# EAGLE design 7seg_clock_ver2 (EAGLE 9.6.2)
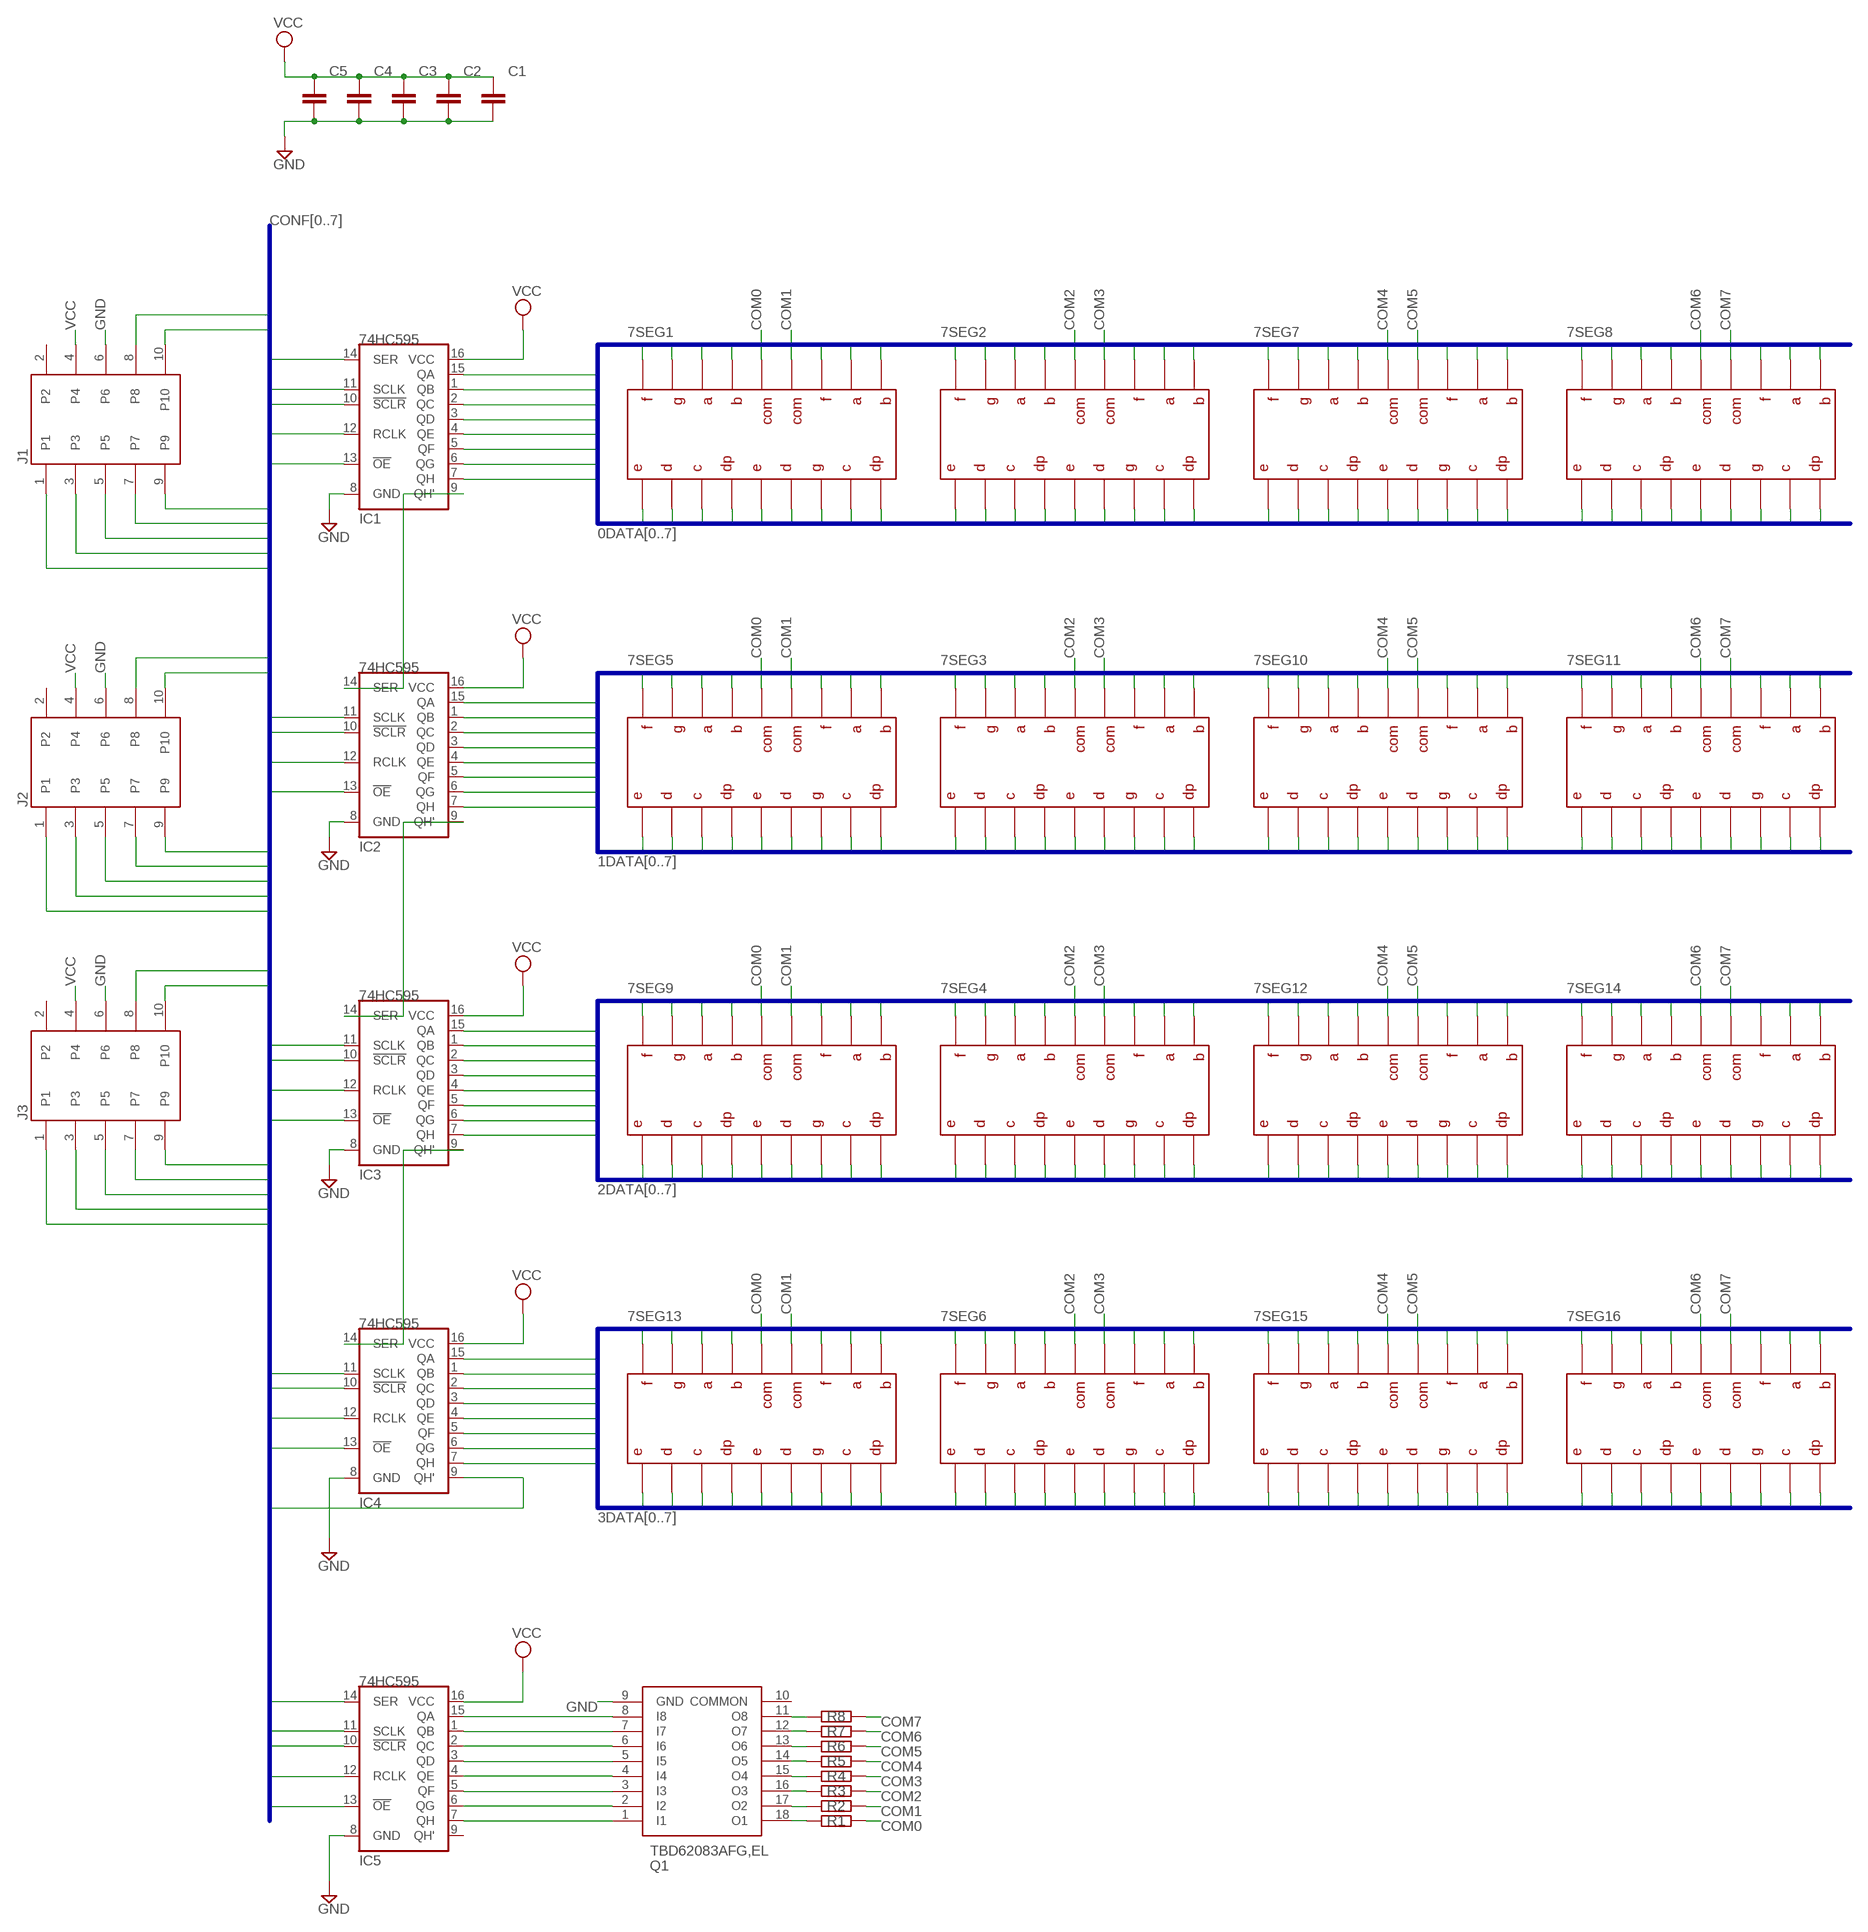
[diagram p0: schematic, sheet 1]

## Parts
7SEG1  SL-3264  [SL-3264]
7SEG2  SL-3264  [SL-3264]
7SEG3  SL-3264  [SL-3264]
7SEG4  SL-3264  [SL-3264]
7SEG5  SL-3264  [SL-3264]
7SEG6  SL-3264  [SL-3264]
7SEG7  SL-3264  [SL-3264]
7SEG8  SL-3264  [SL-3264]
7SEG9  SL-3264  [SL-3264]
7SEG10  SL-3264  [SL-3264]
7SEG11  SL-3264  [SL-3264]
7SEG12  SL-3264  [SL-3264]
7SEG13  SL-3264  [SL-3264]
7SEG14  SL-3264  [SL-3264]
7SEG15  SL-3264  [SL-3264]
7SEG16  SL-3264  [SL-3264]
C1  C_CHIP-0603(1608-METRIC)  [CAPC1608X85]
C2  C_CHIP-0603(1608-METRIC)  [CAPC1608X85]
C3  C_CHIP-0603(1608-METRIC)  [CAPC1608X85]
C4  C_CHIP-0603(1608-METRIC)  [CAPC1608X85]
C5  C_CHIP-0603(1608-METRIC)  [CAPC1608X85]
IC1  74HC595  [SO16]
IC2  74HC595  [SO16]
IC3  74HC595  [SO16]
IC4  74HC595  [SO16]
IC5  74HC595  [SO16]
J1  1241050-5  [TE_1241050-5]
J2  1241050-5  [TE_1241050-5]
J3  1241050-5  [TE_1241050-5]
Q1  TBD62083AFG,EL  [SOIC127P1030X245-18N]
R1  R_CHIP-0603(1608-METRIC)  [RESC1608X60]
R2  R_CHIP-0603(1608-METRIC)  [RESC1608X60]
R3  R_CHIP-0603(1608-METRIC)  [RESC1608X60]
R4  R_CHIP-0603(1608-METRIC)  [RESC1608X60]
R5  R_CHIP-0603(1608-METRIC)  [RESC1608X60]
R6  R_CHIP-0603(1608-METRIC)  [RESC1608X60]
R7  R_CHIP-0603(1608-METRIC)  [RESC1608X60]
R8  R_CHIP-0603(1608-METRIC)  [RESC1608X60]

## Nets
0DATA0: 7SEG1.P$10 7SEG1.P$15 7SEG2.P$10 7SEG2.P$15 7SEG7.P$10 7SEG7.P$15 7SEG8.P$10 7SEG8.P$15 IC1.15(QA)
0DATA1: 7SEG1.P$12 7SEG1.P$18 7SEG2.P$12 7SEG2.P$18 7SEG7.P$12 7SEG7.P$18 7SEG8.P$12 7SEG8.P$18 IC1.1(QB)
0DATA2: 7SEG1.P$7 7SEG1.P$17 7SEG2.P$7 7SEG2.P$17 7SEG7.P$7 7SEG7.P$17 7SEG8.P$7 7SEG8.P$17 IC1.2(QC)
0DATA3: 7SEG1.P$11 7SEG1.P$16 7SEG2.P$11 7SEG2.P$16 7SEG7.P$11 7SEG7.P$16 7SEG8.P$11 7SEG8.P$16 IC1.3(QD)
0DATA4: 7SEG1.P$4 7SEG1.P$9 7SEG2.P$4 7SEG2.P$9 7SEG7.P$4 7SEG7.P$9 7SEG8.P$4 7SEG8.P$9 IC1.4(QE)
0DATA5: 7SEG1.P$3 7SEG1.P$8 7SEG2.P$3 7SEG2.P$8 7SEG7.P$3 7SEG7.P$8 7SEG8.P$3 7SEG8.P$8 IC1.5(QF)
0DATA6: 7SEG1.P$2 7SEG1.P$6 7SEG2.P$2 7SEG2.P$6 7SEG7.P$2 7SEG7.P$6 7SEG8.P$2 7SEG8.P$6 IC1.6(QG)
0DATA7: 7SEG1.P$1 7SEG1.P$5 7SEG2.P$1 7SEG2.P$5 7SEG7.P$1 7SEG7.P$5 7SEG8.P$1 7SEG8.P$5 IC1.7(QH)
1DATA0: 7SEG3.P$10 7SEG3.P$15 7SEG5.P$10 7SEG5.P$15 7SEG10.P$10 7SEG10.P$15 7SEG11.P$10 7SEG11.P$15 IC2.15(QA)
1DATA1: 7SEG3.P$12 7SEG3.P$18 7SEG5.P$12 7SEG5.P$18 7SEG10.P$12 7SEG10.P$18 7SEG11.P$12 7SEG11.P$18 IC2.1(QB)
1DATA2: 7SEG3.P$7 7SEG3.P$17 7SEG5.P$7 7SEG5.P$17 7SEG10.P$7 7SEG10.P$17 7SEG11.P$7 7SEG11.P$17 IC2.2(QC)
1DATA3: 7SEG3.P$11 7SEG3.P$16 7SEG5.P$11 7SEG5.P$16 7SEG10.P$11 7SEG10.P$16 7SEG11.P$11 7SEG11.P$16 IC2.3(QD)
1DATA4: 7SEG3.P$4 7SEG3.P$9 7SEG5.P$4 7SEG5.P$9 7SEG10.P$4 7SEG10.P$9 7SEG11.P$4 7SEG11.P$9 IC2.4(QE)
1DATA5: 7SEG3.P$3 7SEG3.P$8 7SEG5.P$3 7SEG5.P$8 7SEG10.P$3 7SEG10.P$8 7SEG11.P$3 7SEG11.P$8 IC2.5(QF)
1DATA6: 7SEG3.P$2 7SEG3.P$6 7SEG5.P$2 7SEG5.P$6 7SEG10.P$2 7SEG10.P$6 7SEG11.P$2 7SEG11.P$6 IC2.6(QG)
1DATA7: 7SEG3.P$1 7SEG3.P$5 7SEG5.P$1 7SEG5.P$5 7SEG10.P$1 7SEG10.P$5 7SEG11.P$1 7SEG11.P$5 IC2.7(QH)
2DATA0: 7SEG4.P$10 7SEG4.P$15 7SEG9.P$10 7SEG9.P$15 7SEG12.P$10 7SEG12.P$15 7SEG14.P$10 7SEG14.P$15 IC3.15(QA)
2DATA1: 7SEG4.P$12 7SEG4.P$18 7SEG9.P$12 7SEG9.P$18 7SEG12.P$12 7SEG12.P$18 7SEG14.P$12 7SEG14.P$18 IC3.1(QB)
2DATA2: 7SEG4.P$7 7SEG4.P$17 7SEG9.P$7 7SEG9.P$17 7SEG12.P$7 7SEG12.P$17 7SEG14.P$7 7SEG14.P$17 IC3.2(QC)
2DATA3: 7SEG4.P$11 7SEG4.P$16 7SEG9.P$11 7SEG9.P$16 7SEG12.P$11 7SEG12.P$16 7SEG14.P$11 7SEG14.P$16 IC3.3(QD)
2DATA4: 7SEG4.P$4 7SEG4.P$9 7SEG9.P$4 7SEG9.P$9 7SEG12.P$4 7SEG12.P$9 7SEG14.P$4 7SEG14.P$9 IC3.4(QE)
2DATA5: 7SEG4.P$3 7SEG4.P$8 7SEG9.P$3 7SEG9.P$8 7SEG12.P$3 7SEG12.P$8 7SEG14.P$3 7SEG14.P$8 IC3.5(QF)
2DATA6: 7SEG4.P$2 7SEG4.P$6 7SEG9.P$2 7SEG9.P$6 7SEG12.P$2 7SEG12.P$6 7SEG14.P$2 7SEG14.P$6 IC3.6(QG)
2DATA7: 7SEG4.P$1 7SEG4.P$5 7SEG9.P$1 7SEG9.P$5 7SEG12.P$1 7SEG12.P$5 7SEG14.P$1 7SEG14.P$5 IC3.7(QH)
3DATA0: 7SEG6.P$10 7SEG6.P$15 7SEG13.P$10 7SEG13.P$15 7SEG15.P$10 7SEG15.P$15 7SEG16.P$10 7SEG16.P$15 IC4.15(QA)
3DATA1: 7SEG6.P$12 7SEG6.P$18 7SEG13.P$12 7SEG13.P$18 7SEG15.P$12 7SEG15.P$18 7SEG16.P$12 7SEG16.P$18 IC4.1(QB)
3DATA2: 7SEG6.P$7 7SEG6.P$17 7SEG13.P$7 7SEG13.P$17 7SEG15.P$7 7SEG15.P$17 7SEG16.P$7 7SEG16.P$17 IC4.2(QC)
3DATA3: 7SEG6.P$11 7SEG6.P$16 7SEG13.P$11 7SEG13.P$16 7SEG15.P$11 7SEG15.P$16 7SEG16.P$11 7SEG16.P$16 IC4.3(QD)
3DATA4: 7SEG6.P$4 7SEG6.P$9 7SEG13.P$4 7SEG13.P$9 7SEG15.P$4 7SEG15.P$9 7SEG16.P$4 7SEG16.P$9 IC4.4(QE)
3DATA5: 7SEG6.P$3 7SEG6.P$8 7SEG13.P$3 7SEG13.P$8 7SEG15.P$3 7SEG15.P$8 7SEG16.P$3 7SEG16.P$8 IC4.5(QF)
3DATA6: 7SEG6.P$2 7SEG6.P$6 7SEG13.P$2 7SEG13.P$6 7SEG15.P$2 7SEG15.P$6 7SEG16.P$2 7SEG16.P$6 IC4.6(QG)
3DATA7: 7SEG6.P$1 7SEG6.P$5 7SEG13.P$1 7SEG13.P$5 7SEG15.P$1 7SEG15.P$5 7SEG16.P$1 7SEG16.P$5 IC4.7(QH)
COM0 [sup]: 7SEG1.P$14 7SEG5.P$14 7SEG9.P$14 7SEG13.P$14 R1.2
COM1 [sup]: 7SEG1.P$13 7SEG5.P$13 7SEG9.P$13 7SEG13.P$13 R2.2
COM2 [sup]: 7SEG2.P$14 7SEG3.P$14 7SEG4.P$14 7SEG6.P$14 R3.2
COM3 [sup]: 7SEG2.P$13 7SEG3.P$13 7SEG4.P$13 7SEG6.P$13 R4.2
COM4 [sup]: 7SEG7.P$14 7SEG10.P$14 7SEG12.P$14 7SEG15.P$14 R5.2
COM5 [sup]: 7SEG7.P$13 7SEG10.P$13 7SEG12.P$13 7SEG15.P$13 R6.2
COM6 [sup]: 7SEG8.P$14 7SEG11.P$14 7SEG14.P$14 7SEG16.P$14 R7.2
COM7 [sup]: 7SEG8.P$13 7SEG11.P$13 7SEG14.P$13 7SEG16.P$13 R8.2
CONF0: IC1.14(SER) J1.1 J2.1 J3.1
CONF1: IC1.11(SCLK) IC2.11(SCLK) IC3.11(SCLK) IC4.11(SCLK) IC5.11(SCLK) J1.7 J2.7 J3.7
CONF2: IC1.10(!SCLR) IC2.10(!SCLR) IC3.10(!SCLR) IC4.10(!SCLR) IC5.10(!SCLR) J1.9 J2.9 J3.9
CONF3: IC1.12(RCLK) IC2.12(RCLK) IC3.12(RCLK) IC4.12(RCLK) IC5.12(RCLK) J1.5 J2.5 J3.5
CONF4: IC1.13(!OE) IC2.13(!OE) IC3.13(!OE) IC4.13(!OE) IC5.13(!OE) J1.3 J2.3 J3.3
CONF5: IC4.9(QH') J1.10 J2.10 J3.10
CONF6: IC5.14(SER) J1.8 J2.8 J3.8
GND [sup]: C1.2 C2.2 C3.2 C4.2 C5.2 IC1.8(GND) IC2.8(GND) IC3.8(GND) IC4.8(GND) IC5.8(GND) J1.6 J2.6 J3.6 Q1.9(GND)
N$1: IC1.9(QH') IC2.14(SER)
N$2: Q1.18(O1) R1.1
N$3: Q1.17(O2) R2.1
N$4: IC3.9(QH') IC4.14(SER)
N$5: Q1.16(O3) R3.1
N$6: IC5.7(QH) Q1.1(I1)
N$7: IC5.6(QG) Q1.2(I2)
N$8: IC5.5(QF) Q1.3(I3)
N$9: IC5.4(QE) Q1.4(I4)
N$10: Q1.15(O4) R4.1
N$11: Q1.14(O5) R5.1
N$12: IC5.3(QD) Q1.5(I5)
N$13: IC5.2(QC) Q1.6(I6)
N$14: IC5.1(QB) Q1.7(I7)
N$15: IC5.15(QA) Q1.8(I8)
N$16: Q1.13(O6) R6.1
N$17: Q1.12(O7) R7.1
N$18: Q1.11(O8) R8.1
N$19: IC2.9(QH') IC3.14(SER)
VCC [sup]: C1.1 C2.1 C3.1 C4.1 C5.1 IC1.16(VCC) IC2.16(VCC) IC3.16(VCC) IC4.16(VCC) IC5.16(VCC) J1.4 J2.4 J3.4
Unconnected: IC5.9(QH') J1.2 J2.2 J3.2 Q1.10(COMMON)

## Buses
CONF[0..7]
3DATA[0..7]
2DATA[0..7]
1DATA[0..7]
0DATA[0..7]

## Library data of the parts
7SEG1-7SEG16 = SL3264:SL-3264; SL-3264: 三洋 7セグメントLED
C1-C5 = Capacitor:C: Capacitor - Generic; CATEGORY: Capacitor
IC1-IC5 = 74HC595N:74HC595: 8-bit SHIFT REGISTER, output latch Check availability <https://pricing.snapeda.com/parts/74HC595/Nexperia/view-part?ref=eda>; AVAILABILITY: In Stock; DESCRIPTION: Shift Register Single 8-Bit Serial to Serial/Parallel 16-Pin SSOP T/R; MF: Nexperia; MP: 74HC595; PACKAGE: None; PRICE: None; PURCHASE-URL: https://pricing.snapeda.com/search/part/74HC595/?ref=eda
J1-J3 = PinHead_2.54_2line:1241050-5: Conn Unshrouded Header HDR 10 POS 2.54mm Solder ST SMD Automotive T/R Check availability <https://pricing.snapeda.com/parts/1241050-5/TE%20Connectivity/view-part?ref=eda>; AVAILABILITY: In Stock; COMMENT: 1241050-5; DESCRIPTION: Conn Unshrouded Header HDR 10 POS 2.54mm Solder ST SMD Automotive Reel; EU_ROHS_COMPLIANCE: Compliant; MF: TE Connectivity; MP: 1241050-5; PACKAGE: None; PRICE: None; PURCHASE-URL: https://pricing.snapeda.com/search/part/1241050-5/?ref=eda
Q1 = TBD62083AFG_EL:TBD62083AFG,EL: Gate Drivers DMOS Transistor Array 7-CH, 50V/0.5A Source: Datasheet <https://componentsearchengine.com/Datasheets/1/TBD62083AFG,EL.pdf> Check availability <https://pricing.snapeda.com/parts/TBD62083AFG%2CEL/Toshiba%20Semiconductor/view-part?ref=eda>; AVAILABILITY: In Stock; DESCRIPTION: Power Switch/Driver 1:1 N-Channel 500mA 18-SOP; MF: Toshiba Semiconductor; MP: TBD62083AFG,EL; PACKAGE: SOIC-18 Toshiba Semiconductor and Storage; PRICE: None; PURCHASE-URL: https://pricing.snapeda.com/search/part/TBD62083AFG,EL/?ref=eda
R1-R8 = Resistor:R: Resistor Fixed - Generic; CATEGORY: Resistor; SUB-CATEGORY: Fixed

## Net classes
0 default: width 0.203 mm, clearance 0.203 mm
1 sup: width 0.762 mm, clearance 0.33 mm

## Board
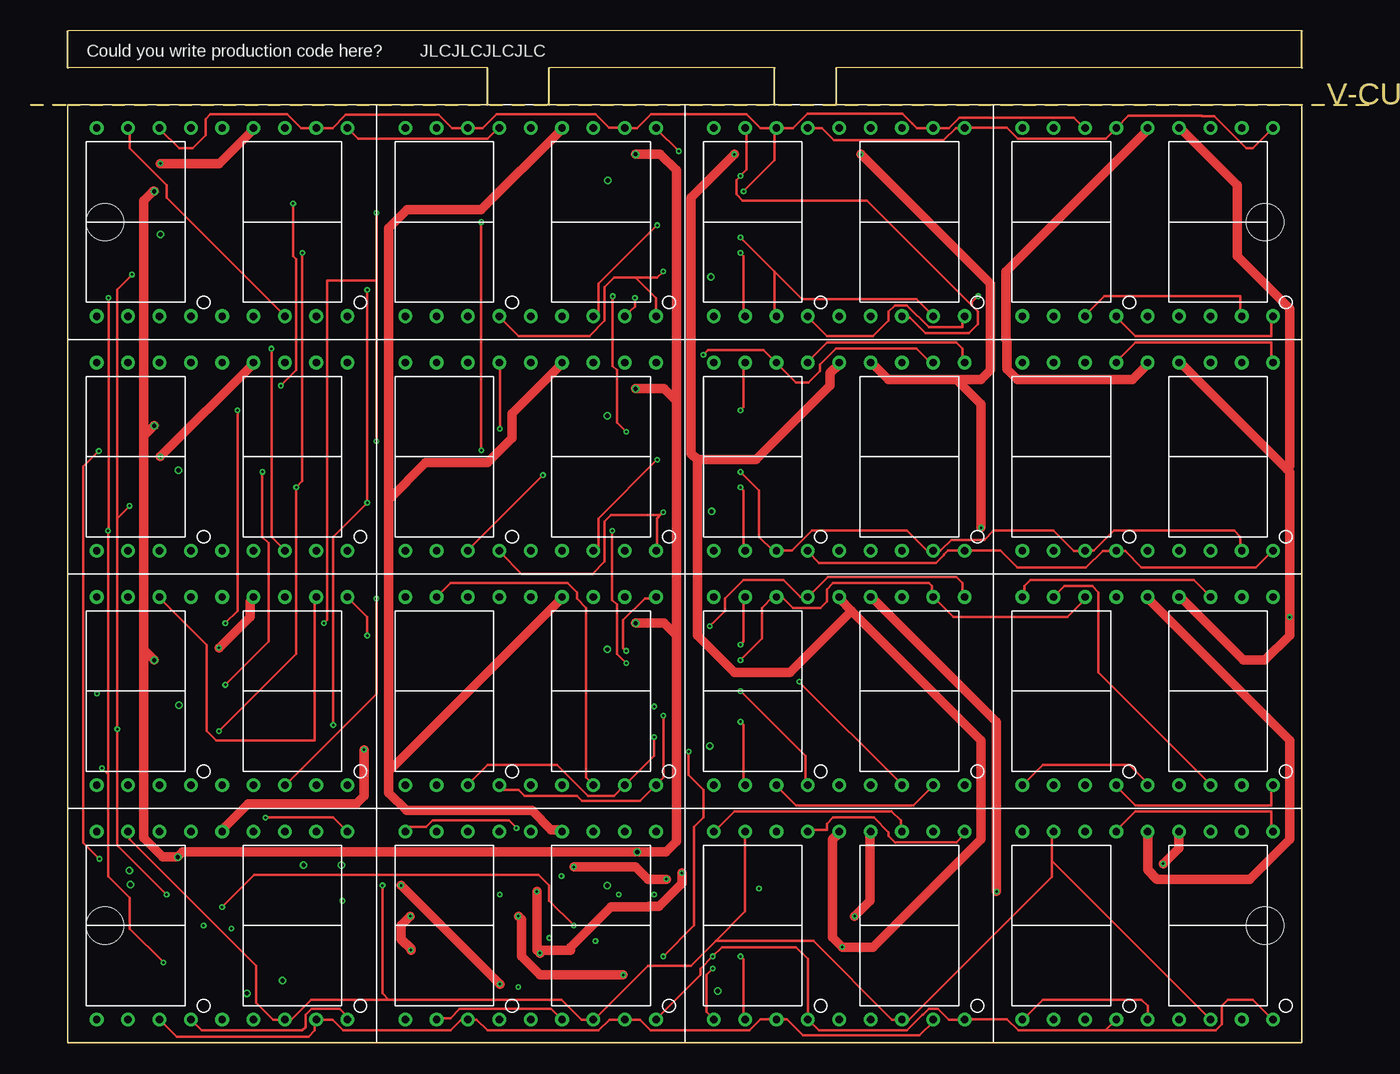
[diagram p1: board, top side]
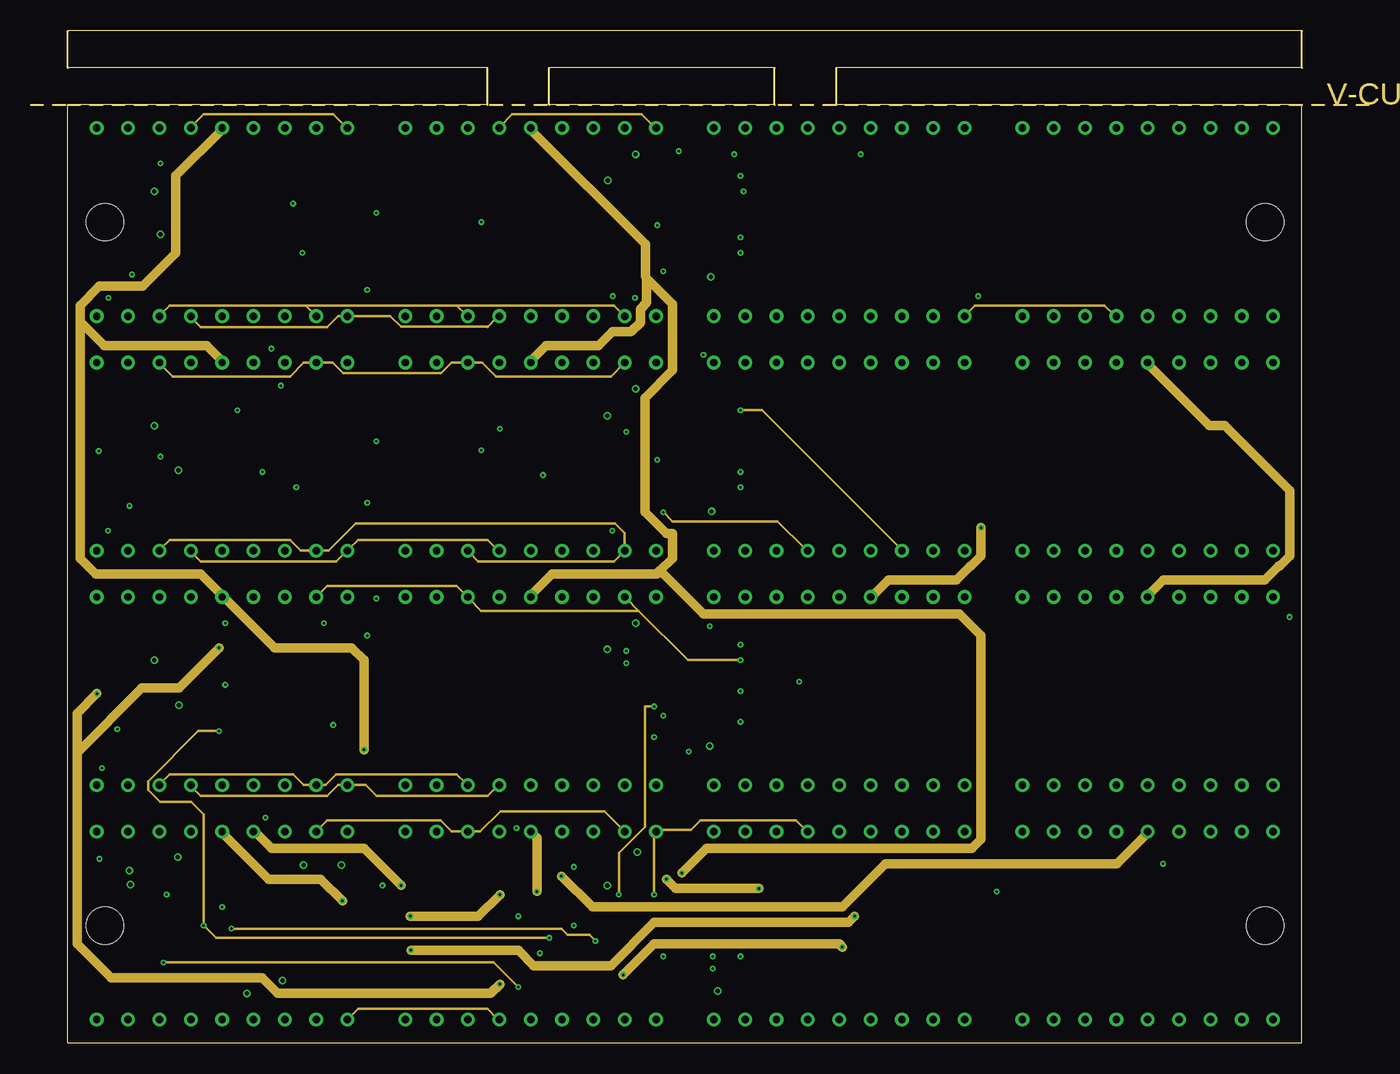
[diagram p2: board, inner layer Route2]
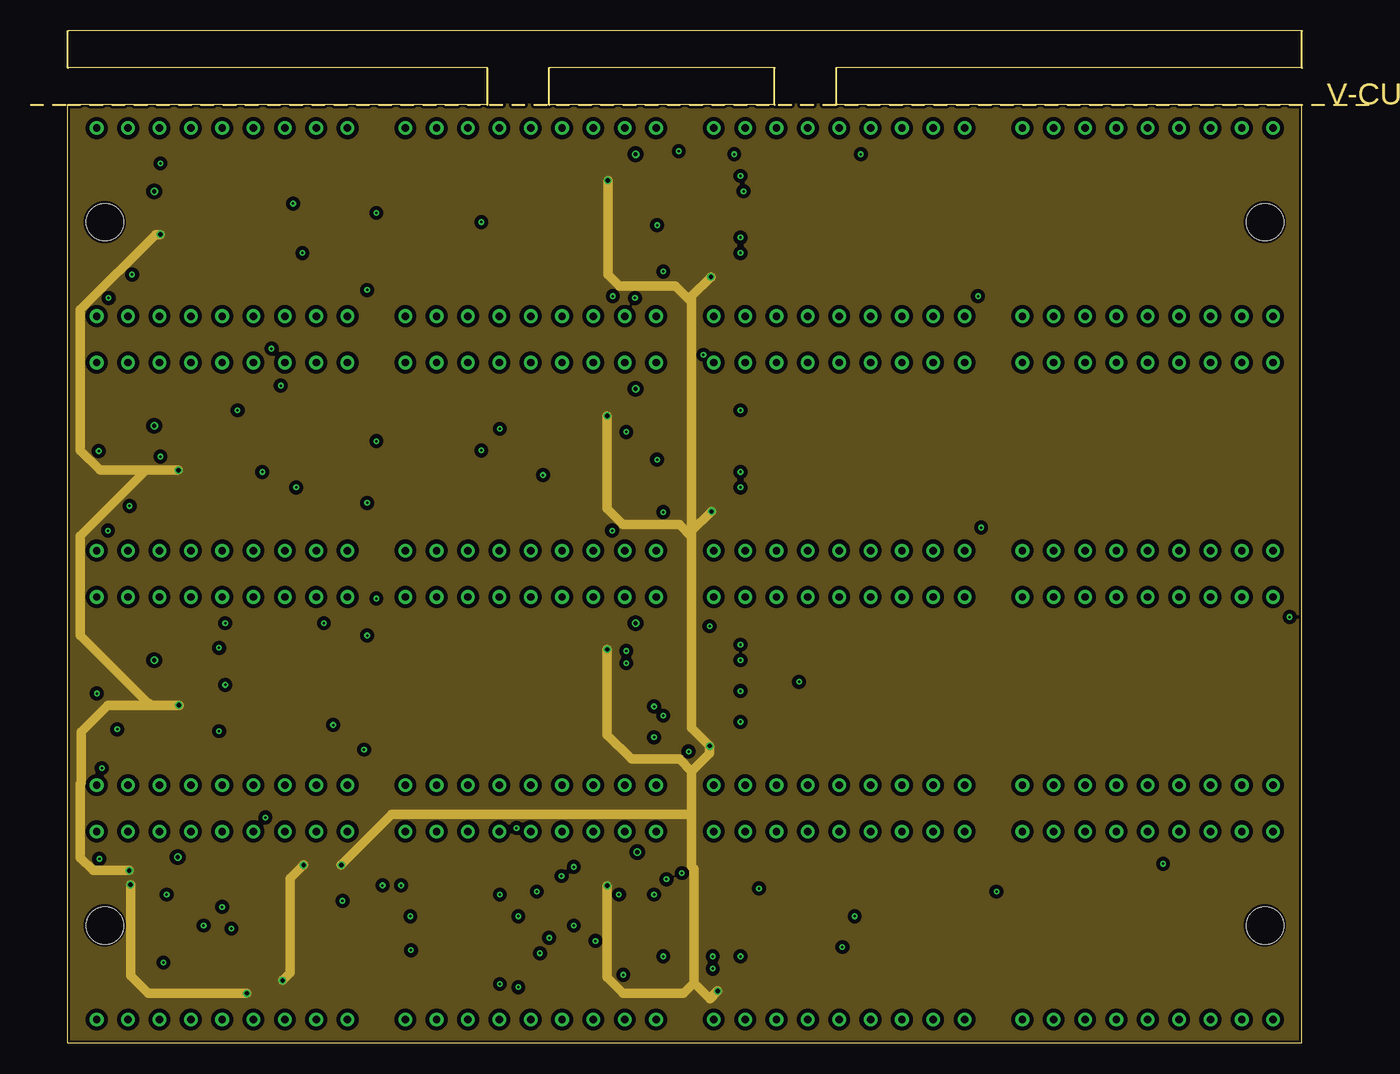
[diagram p3: board, inner layer Route15]
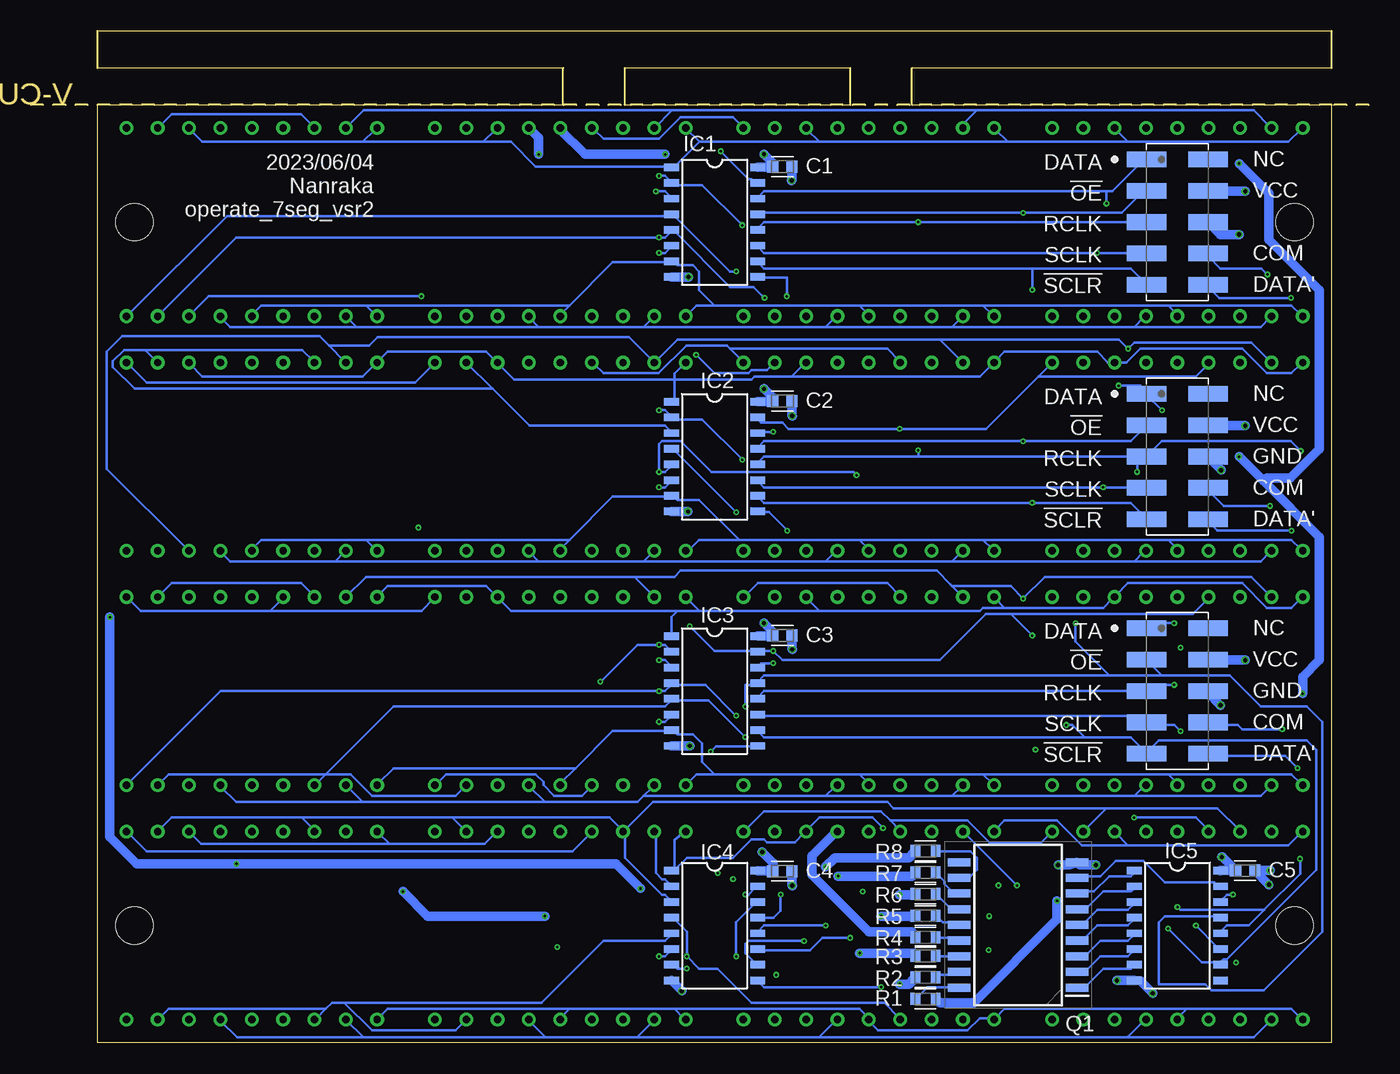
[diagram p4: board, bottom side, seen from below]

Size 108.4 x 82 mm. Coordinates in mm from the lower left corner, seen from the top.
Outline: 3,76 37,76 37,79 3,79 3,82 103,82 103,79 65.26,79 65.26,76 103,76 103,0 3,0 3,76
Outline: 0,76 3,76
Outline: 3,76 109,76
Outline: 42,76 42,79 60.26,79 60.26,76 42,76
Copper layers (1+2*15+16): Top 0.035mm / dielectric 0.2mm / Route2 0.0175mm / dielectric 1.065mm / Route15 0.0175mm / dielectric 0.2mm / Bottom 0.035mm
Design rules "jlcpcb-4layers": minimum track width 3.5mil, minimum drill 0.2mm, track to track 5mil, track to pad 0.2mm, pad to pad 5mil, via to via 0.5mm, smd to smd 5mil, copper to edge 0.2mm, drill to drill 6mil, minimum pad ring 10mil, minimum via ring 0.13mm, stop-mask expansion 0.05mm, vias tented up to drill 16mil, thermal gap 10mil
Holes 3 mm at 6,66.5 6,9.5 100,9.5 100,66.5

### Footprints (pad centres in the part's own frame; a part is rotated, then mirrored left to right if it is on the bottom)
SL-3264 = drill 0.6: P$1 -10.16,-7.62; P$2 -7.62,-7.62; P$3 -5.08,-7.62; P$4 -2.54,-7.62; P$5 0,-7.62; P$6 2.54,-7.62; P$7 5.08,-7.62; P$8 7.62,-7.62; P$9 10.16,-7.62; P$10 10.16,7.62; P$11 7.62,7.62; P$12 5.08,7.62; P$13 2.54,7.62; P$14 0,7.62; P$15 -2.54,7.62; P$16 -5.08,7.62; P$17 -7.62,7.62; P$18 -10.16,7.62
CAPC1608X85 = smd 0.921 x 0.97: 1 -0.775,0; 2 0.775,0
SO16 = smd 0.6 x 1.2: 1 -4.445,-3.494; 2 -3.175,-3.494; 3 -1.905,-3.494; 4 -0.635,-3.494; 5 0.635,-3.494; 6 1.905,-3.494; 7 3.175,-3.494; 8 4.445,-3.494; 9 4.445,3.494; 10 3.175,3.494; 11 1.905,3.494; 12 0.635,3.494; 13 -0.635,3.494; 14 -1.905,3.494; 15 -3.175,3.494; 16 -4.445,3.494
TE_1241050-5 = smd 1.27 x 3.2: 1 -5.08,-2.5; 2 -5.08,2.5; 3 -2.54,-2.5; 4 -2.54,2.5; 5 0,-2.5; 6 0,2.5; 7 2.54,-2.5; 8 2.54,2.5; 9 5.08,-2.5; 10 5.08,2.5
SOIC127P1030X245-18N = smd 1.8 x 0.65: 1 -4.775,5.08; 2 -4.775,3.81; 3 -4.775,2.54; 4 -4.775,1.27; 5 -4.775,0; 6 -4.775,-1.27; 7 -4.775,-2.54; 8 -4.775,-3.81; 9 -4.775,-5.08; 10 4.775,-5.08; 11 4.775,-3.81; 12 4.775,-2.54; 13 4.775,-1.27; 14 4.775,0; 15 4.775,1.27; 16 4.775,2.54; 17 4.775,3.81; 18 4.775,5.08
RESC1608X60 = smd 0.799 x 0.974: 1 -0.815,0; 2 0.815,0

### Placement (x,y rotation side)
7SEG1  15.5,66.5 0 top
7SEG2  40.5,66.5 0 top
7SEG3  40.5,47.5 0 top
7SEG4  40.5,28.5 0 top
7SEG5  15.5,47.5 0 top
7SEG6  40.5,9.5 0 top
7SEG7  65.5,66.5 0 top
7SEG8  90.5,66.5 0 top
7SEG9  15.5,28.5 0 top
7SEG10  65.5,47.5 0 top
7SEG11  90.5,47.5 0 top
7SEG12  65.5,28.5 0 top
7SEG13  15.5,9.5 0 top
7SEG14  90.5,28.5 0 top
7SEG15  65.5,9.5 0 top
7SEG16  90.5,9.5 0 top
C1  47.5,71 0 bottom
C2  47.5,52 0 bottom
C3  47.5,33 0 bottom
C4  47.5,13.9 0 bottom
C5  10,13.95 0 bottom
IC1  53,66.5 270 bottom
IC2  53,47.5 270 bottom
IC3  53,28.5 270 bottom
IC4  53,9.5 270 bottom
IC5  15.5,9.5 270 bottom
J1  15.5,66.5 270 bottom
J2  15.5,47.5 270 bottom
J3  15.5,28.5 270 bottom
Q1  28.4,9.55 180 bottom
R1  35.9,3.55 0 bottom
R2  35.9,5.3 180 bottom
R3  35.9,7.05 180 bottom
R4  35.9,8.55 180 bottom
R5  35.9,10.3 180 bottom
R6  35.9,12.05 180 bottom
R7  35.9,13.8 180 bottom
R8  35.9,15.55 180 bottom

### Tracks (layer width: path | path; a pad name or v marks a point on that pad's centre or on a via)
0DATA0  (via drill 0.2)
  Top 0.203: 7SEG2.P$15 37.75,74 37,73.25 26.53,73.25 7SEG1.P$10 | v52.5,72.25 50.75,74 7SEG2.P$10 | 7SEG8.P$10 100.5,74 99,72.5 98.5,72.5 95.9,75.1 94.9,75.1 94.89,75.11 88.95,75.11 7SEG8.P$15 87.1,73.26 79.98,73.26 79.09,74.15 75.69,74.15 7SEG7.P$10 74.94,74.12 73.96,73.13 65.09,73.13 64.11,74.12 7SEG7.P$15
  Route2 0.203: 7SEG1.P$15 13,74.25 14,75.25 24.5,75.25 25.5,74.25 7SEG1.P$10 | 7SEG2.P$15 38,74.25 39,75.25 49.5,75.25 50.5,74.25 7SEG2.P$10
  Bottom 0.203: v52.5,72.25 50.25,70 50,70 49.75,69.75 IC1.15 | 7SEG7.P$15 62.75,74 62,73.25 57.5,73.25 55.75,75 51.5,75 50.75,74.25 7SEG2.P$10
0DATA1
  Bottom 0.203: 19.5,73 6.5,73 5.5,74 7SEG1.P$18 | 19.5,73 20.5,74 7SEG1.P$12 | 29.25,73 30.25,74 7SEG2.P$18 | 19.5,73 29.25,73 | 71.75,73 70.75,74 7SEG7.P$12 | 81.5,73 71.75,73 | 81.5,73 94.5,73 95.5,74 7SEG8.P$12 | 81.5,73 80.5,74 7SEG8.P$18 | 44.5,73 45.5,74 7SEG2.P$12 | 29.25,73 44.5,73 | 7SEG7.P$18 54.22,73 | 54.22,73 44.5,73 | 54.22,73 56.27,70.94 IC1.1 56.5,71 67.5,71 69.5,73 71.75,73
0DATA2  (via drill 0.2)
  Top 0.203: 7SEG1.P$7 20.5,59 11,68.5 11,69.5 8,72.5 8,74 7SEG1.P$17 | 7SEG7.P$17 58,74 58,70.75 v57.5,70.25 57.16,69.91 57.16,68.76 57.67,68.25 67.75,68.25 76.25,59.75 | v50.75,66.25 46,61.5 46,59.25 45.75,59 7SEG2.P$7 | 76.25,59.75 76.75,59.25 76.75,58.25 76,57.5 72.5,57.5 71.25,58.75 70.75,58.75 7SEG7.P$7 | v76.75,60.5 76.25,60 76.25,59.75
  Bottom 0.203: 7SEG2.P$17 32.88,74.43 31.75,75.56 | 31.75,75.56 9.31,75.56 8,74.25 7SEG1.P$17 | v57.5,70.25 57,70.25 56.5,69.75 IC1.2 56.25,69.5 54,69.5 v50.75,66.25 | 7SEG8.P$17 81.45,75.55 56.45,75.55 | v76.75,60.5 94,60.5 95.5,59 7SEG8.P$7 | 7SEG7.P$17 56.45,75.55 | 56.45,75.55 56.44,75.56 31.75,75.56
0DATA3  (via drill 0.2)
  Top 0.203: 7SEG1.P$16 10.5,74 12,72.5 13.1,72.5 14.15,73.55 14.15,74.85 14.55,75.25 20.75,75.25 21.9,74.1 23.1,74.1 7SEG1.P$11 24.45,74.12 25.52,75.2 33.05,75.2 34.13,74.12 7SEG2.P$16 36.62,74.12 37.75,75.25 45.75,75.25 46.85,74.15 48.09,74.15 7SEG2.P$11 49.12,74.12 50.25,75.25 58,75.25 59.13,74.12 7SEG7.P$16 | v57.75,69 60.25,71.5 60.25,74 7SEG7.P$16 | 7SEG8.P$16 85.25,74.25 84.52,74.98 75.23,74.98 74.37,74.12 7SEG7.P$11 71.78,74.12 71.44,74.46 71.44,74.48 70.61,75.31 62.93,75.31 61.74,74.12 7SEG7.P$16
  Bottom 0.203: v57.75,69 57,69 56.5,68.5 IC1.3 | 7SEG8.P$11 98,74.25 97,75.25 86.5,75.25 85.5,74.25 7SEG8.P$16
0DATA4  (via drill 0.2)
  Top 0.203: 7SEG7.P$4 63,58.75 64.5,57.25 68.25,57.25 69.5,58.5 69.5,59.25 70,59.75 71,59.75 72.75,58 75.5,58 75.5,58.75 7SEG7.P$9 | 7SEG8.P$4 88,58.75 89.5,57.25 100.5,57.25 100.5,58.75 7SEG8.P$9 | v51.25,62.5 50.75,62 49,62 | 7SEG2.P$4 38,58.75 39.5,57.25 45.25,57.25 46.5,58.5 46.5,61.25 47.25,62 49,62 | 49,62 50.66,60.34 7SEG2.P$9
  Route2 0.203: 7SEG7.P$9 75.75,59 76.5,59.75 87,59.75 87.75,59 7SEG8.P$4 | 7SEG1.P$4 13,58.75 13.75,58 24,58 24.88,58.88 7SEG1.P$9 29.12,58.88 29.98,58.02 36.98,58.02 37,58 37.75,58.75 7SEG2.P$4
  Bottom 0.203: v51.25,62.5 51.75,62.5 56.25,67 IC1.4 56.5,67 92.5,67 100.5,59 7SEG8.P$9
0DATA5  (via drill 0.2)
  Top 0.203: 7SEG8.P$3 85.5,59 87,60.5 98,60.5 98,59 7SEG8.P$8 | v57.5,65.25 60.25,62.5 | 60.25,62.5 60.25,60.25 60.25,59 7SEG7.P$3 | 7SEG7.P$8 71.75,60.25 63,60.25 62.5,60.25 60.25,62.5 | v48.95,60.35 48.95,59.65 7SEG2.P$8
  Route2 0.203: 22.25,59.75 11.25,59.75 10.5,59 7SEG1.P$3 | 7SEG1.P$8 22.25,59.75 | 34.5,59.75 35.25,59 7SEG2.P$3 | 22.25,59.75 34.5,59.75 | 7SEG2.P$8 47.25,59.75 34.5,59.75
  Bottom 0.203: 7SEG8.P$8 91.75,65.25 v57.5,65.25 57,65.25 56.5,65.75 IC1.5 56.25,65.75 51.75,61.25 49.85,61.25 v48.95,60.35
0DATA6  (via drill 0.2)
  Top 0.203: v57.5,64 57.75,63.75 57.75,59 7SEG7.P$2
  Bottom 0.203: 7SEG1.P$2 8,58.75 8.75,58 17,58 17.25,58 19,58 | 33.75,58 33,58.75 7SEG2.P$2 | 44,58 33.75,58 | 19,58 18.25,58.75 7SEG1.P$6 | 33.75,58 19,58 | 82,58 92.25,58 93,58.75 7SEG8.P$6 | v57.5,64 57,64 56.5,64.5 IC1.6 | 67.25,58 68,58.75 7SEG7.P$6 | 58.75,58 67.25,58 | 58.75,58 58,58.75 7SEG7.P$2 | 82,58 7SEG8.P$2 | 67.25,58 82,58 | 44,58 43.25,58.75 7SEG2.P$6 | 58.75,58 44,58
0DATA7
  Bottom 0.203: 16.25,59.75 6.25,59.75 5.5,59 7SEG1.P$1 | 31.25,59.75 30.5,59 7SEG2.P$1 | 31.25,59.75 39.75,59.75 41.25,59.75 | 16.25,59.75 15.5,59 7SEG1.P$5 | 31.25,59.75 16.25,59.75 | 81.25,59.75 80.5,59 7SEG8.P$1 | 81.25,59.75 89.75,59.75 90.5,59 7SEG8.P$5 | 64.75,59.75 61.25,63.25 56.5,63.25 IC1.7 56.25,63.25 56,63 54.75,63 54.25,62.5 54.25,61 53,59.75 | 64.75,59.75 65.5,59 7SEG7.P$5 | 41.25,59.75 40.5,59 7SEG2.P$5 | 53,59.75 54.47,59.75 7SEG7.P$1 | 53,59.75 41.25,59.75 | 64.75,59.75 81.25,59.75
1DATA0  (via drill 0.2)
  Top 0.203: 7SEG11.P$15 88,55.25 89.5,56.75 100.5,56.75 100.5,55.25 7SEG11.P$10 | 7SEG10.P$15 63,55.25 64.5,56.75 75,56.75 75.5,56.25 75.5,55.25 7SEG10.P$10 | v38,49.75 38,55 7SEG3.P$15
  Bottom 0.203: 26.75,54 25.75,55 7SEG5.P$10 | 26.75,54 31,49.75 v38,49.75 47,49.75 47.5,50.25 49.25,50.25 49.5,50.5 IC2.15 | 26.75,54 14,54 13,55 7SEG5.P$15 | 7SEG3.P$15 38,55.25 39,56.25 51.75,56.25 | 51.75,56.25 52,56.5 55.28,56.5 57.53,54.25 62,54.25 62.75,55 7SEG10.P$15 | 51.75,56.25 50.75,55.25 7SEG3.P$10 | 7SEG11.P$10 100.5,55 99,53.5 77.25,53.5 75.75,55 7SEG10.P$10
1DATA1
  Bottom 0.203: 7SEG5.P$18 5.5,55 6.25,54.25 8.25,54.25 10.25,56.25 18.5,56.25 19.65,55.1 20.56,55.1 7SEG5.P$12 21.12,55.12 22,56 29.5,56 30.25,55.25 7SEG3.P$18 30.5,55 31.5,54 46.75,54 | 56.25,53.75 56.25,52 IC2.1 | 46.75,54 45.75,55 7SEG3.P$12 | 46.75,54 49.75,54 50,53.75 56.25,53.75 | 7SEG11.P$12 95.5,55 94.5,54 81.5,54 80.5,55 7SEG11.P$18 80.25,55.25 79.5,56 71.5,56 70.75,55.25 7SEG10.P$12 70.5,55 69.25,53.75 56.25,53.75 | 7SEG10.P$18 56.25,54.21 56.25,53.75
1DATA2  (via drill 0.2)
  Top 0.203: v19.5,56.25 19.5,41 20.5,40 7SEG5.P$7 | v57.5,51.25 57.75,51.5 57.75,55 7SEG10.P$17 | v50.75,47.25 46,42.5 46,40.25 45.75,40 7SEG3.P$7
  Route2 0.203: v57.5,51.25 59.25,51.25 70.5,40 7SEG10.P$7
  Bottom 0.203: 7SEG5.P$17 8,55.25 9.5,56.75 19,56.75 v19.5,56.25 20.25,57 31,57 34.75,57 | v57.5,51.25 57,51.25 56.5,50.75 IC2.2 56.25,50.5 54,50.5 v50.75,47.25 | 84.25,56.5 83,55.25 7SEG11.P$17 | 7SEG11.P$7 95.75,40 102.25,46.5 102.25,56 101,57.25 85,57.25 84.25,56.5 | 34.75,57 33,55.25 7SEG3.P$17 | 34.75,57 56,57 7SEG10.P$17 58,55.25 59.95,57.2 80.3,57.2 81,56.5 84.25,56.5
1DATA3  (via drill 0.2)
  Top 0.203: 7SEG10.P$11 73,55 71.75,56.25 65.24,56.25 63.94,54.95 63.94,54.44 63,53.5 62,53.5 60.5,55 7SEG10.P$16 60.25,55.25 59.38,56.12 54.88,56.12 v54.5,55.75
  Route2 0.203: 7SEG5.P$16 10.5,55 11.5,54 21,54 22.1,55.1 23.1,55.1 7SEG5.P$11 24.45,55.12 25.3,54.26 25.99,54.26 26,54.25 33,54.25 33.01,54.26 33.24,54.26 34.09,55.12 7SEG3.P$16 36.58,55.12 37.7,54 47,54 7SEG3.P$11
  Bottom 0.203: 7SEG11.P$16 85.5,55.25 86.4,56.15 97.1,56.15 99.05,56.15 | 7SEG10.P$11 71,53 | 71,53 68,50 57,50 56.5,49.5 IC2.3 | 7SEG11.P$11 99.1,56.1 99.05,56.15 | 99.05,56.15 100.85,56.15 101.75,55.25 101.75,54.75 100,53 71,53 | v54.5,55.75 53,54.25 50.25,54.25 50,54.5 48.75,54.5 48.25,55 7SEG3.P$11
1DATA4  (via drill 0.2)
  Top 0.203: 7SEG10.P$4 63,39.75 63.88,38.88 73.33,38.88 73.98,39.52 73.98,39.56 74.3,39.88 7SEG10.P$9 78.57,39.88 79.95,38.5 85.5,38.5 86.85,39.85 87.93,39.85 7SEG11.P$4 88.01,39.83 88.67,39.83 90,38.5 99.25,38.5 100.5,39.75 7SEG11.P$9 | 51,42.75 50.75,42.5 50.75,40 7SEG3.P$9 | 51,42.75 v51.25,43 | 51,42.75 47,42.75 46.5,42.25 46.5,39 45.5,38 39.75,38 38,39.75 7SEG3.P$4
  Route2 0.203: 7SEG5.P$4 13,39.75 13.75,39 24.75,39 25.5,39.75 7SEG5.P$9 25.75,40 26.5,40.75 37,40.75 37.75,40 7SEG3.P$4 | v51.25,43 52,42.25 60.5,42.25 62.75,40 7SEG10.P$4
  Bottom 0.203: v51.25,43 56.25,48 IC2.4
1DATA5  (via drill 0.2)
  Top 0.203: 7SEG11.P$8 98,40 98,41 97.5,41.5 87.75,41.5 86.13,39.88 7SEG11.P$3 85.39,39.85 84.5,39.85 82.85,41.5 78,41.5 77.25,40.75 74.59,40.75 73.72,39.88 7SEG10.P$8 72.62,39.88 71,41.5 63.3,41.5 61.68,39.88 7SEG10.P$3 60.12,39.88 59,41 59,44.75 v57.5,46.25 | v41.5,46 35.5,40 7SEG3.P$3
  Route2 0.203: 7SEG5.P$3 10.5,40 11.25,40.75 21,40.75 21.87,39.88 7SEG5.P$8 24.13,39.88 26.34,42.09 47.34,42.09 48.12,41.31 7SEG3.P$8 47.24,39 36.25,39 35.5,39.75 7SEG3.P$3
  Bottom 0.203: IC2.5 56.5,46.75 57,46.25 v57.5,46.25 57.5,48.5 57.25,48.75 55.75,48.75 53.25,46.25 41.75,46.25 v41.5,46
1DATA6  (via drill 0.2)
  Top 0.203: v57.5,45 57.75,44.75 57.75,40 7SEG10.P$2
  Bottom 0.203: 19,39 8.75,39 8,39.75 7SEG5.P$2 | 33.75,39 33,39.75 7SEG3.P$2 | 33.75,39 42.25,39 44,39 | 19,39 18.25,39.75 7SEG5.P$6 | 33.75,39 19,39 | 83.75,39 83,39.75 7SEG11.P$2 | 83.75,39 92.25,39 93,39.75 7SEG11.P$6 | v57.5,45 57,45 56.5,45.5 IC2.6 | 67.25,39 68,39.75 7SEG10.P$6 | 58.75,39 67.25,39 | 58.75,39 58,39.75 7SEG10.P$2 | 67.25,39 83.75,39 | 44,39 43.25,39.75 7SEG3.P$6 | 58.75,39 44,39
1DATA7
  Bottom 0.203: 16.25,40.75 6.25,40.75 5.5,40 7SEG5.P$1 | 31.25,40.75 30.5,40 7SEG3.P$1 | 16.25,40.75 15.5,40 7SEG5.P$5 | 31.25,40.75 16.25,40.75 | 81.25,40.75 80.5,40 7SEG11.P$1 | 81.25,40.75 89.75,40.75 90.5,40 7SEG11.P$5 | 64.75,40.75 61.25,44.25 56.5,44.25 IC2.7 56.25,44.25 56,44 54.25,44 51,40.75 | 64.75,40.75 65.5,40 7SEG10.P$5 | 64.75,40.75 81.25,40.75 | 41.25,40.75 40.5,40 7SEG3.P$5 | 51,40.75 54.25,40.75 55.12,39.88 7SEG10.P$1 | 51,40.75 41.25,40.75 | 31.25,40.75 41.25,40.75
2DATA0  (via drill 0.2)
  Top 0.203: 7SEG12.P$10 75.5,36.25 75.5,37.25 75,37.75 64.59,37.75 7SEG12.P$15 62.38,36.12 61,37.5 57.75,37.5 56.25,36 56.25,35 v55,33.75 | v48.25,31.75 48,32 48,34.25 49.75,36 50.5,36 7SEG4.P$10 | v27.25,33 27.25,34.5 25.75,36 7SEG9.P$10
  Bottom 0.203: 89,35 76.75,35 75.75,36 7SEG12.P$10 | 89,35 99.5,35 100.5,36 7SEG14.P$10 | 89,35 88,36 7SEG14.P$15 | 29,34.75 31,34.75 34.75,31 47.5,31 v48.25,31.75 49.5,31.75 IC3.15 49.75,31.75 53,31.75 v55,33.75 | 29,34.75 27.25,34.75 14.25,34.75 13,36 7SEG9.P$15 | 7SEG4.P$15 38,36.25 39,37.25 49.5,37.25 50.5,36.25 7SEG4.P$10 | v27.25,33 29,34.75
2DATA1
  Top 0.203: 7SEG14.P$12 95.5,36.25 94.25,37.5 81,37.5 80.5,37 80.5,36.25 7SEG14.P$18
  Bottom 0.203: 7SEG9.P$18 5.5,36 6.25,35.25 8.25,35.25 10.25,37.25 19.5,37.25 20.5,36.25 7SEG9.P$12 20.75,36 21.5,35.25 29.5,35.25 | 29.5,35.25 30.25,36 7SEG4.P$18 | 7SEG14.P$18 80.25,36.25 79.5,37 71.5,37 70.75,36.25 7SEG12.P$12 70.5,36 69.5,35 56.25,35 56,35 | 44.5,35 31.5,35 31.25,35.25 29.5,35.25 | 44.5,35 45.5,36 7SEG4.P$12 | 44.5,35 54.22,35 | 54.22,35 56,35 | 7SEG12.P$18 54.22,35 | 56,35 56.49,34.51 IC3.1
2DATA2  (via drill 0.2)
  Top 0.203: v28,36 28,28.25 20.75,21 7SEG9.P$7 | 7SEG4.P$7 45.5,21 45,21.5 45,35.25 44.25,36 44.25,36.5 43.5,37.25 34.01,37.25 7SEG4.P$17 | v57.5,32.25 57.75,32.5 57.75,36 7SEG12.P$17 | v62.25,29.25 70.5,21 7SEG12.P$7 | 7SEG14.P$7 95.5,21 86.5,30 86.5,36.5 86,37 83.76,37 7SEG14.P$17
  Bottom 0.203: 7SEG9.P$17 8,36.25 9.5,37.75 26.25,37.75 v28,36 29,37 32,37 33.75,37 | IC3.2 56.5,31.75 57,32.25 v57.5,32.25 59.25,32.25 v62.25,29.25 | 7SEG14.P$17 81.25,37.75 59.5,37.75 | 59.5,37.75 58,36.25 7SEG12.P$17 | 33.75,37 33,36.25 7SEG4.P$17 | 59.5,37.75 56.25,37.75 55.75,38.25 35,38.25 33.88,37.12 33.75,37
2DATA3  (via drill 0.2)
  Top 0.203: 7SEG9.P$16 10.5,36 14.25,32.25 14.25,25.25 15,24.5 23,24.5 23,36 7SEG9.P$11 | v57.5,31 59.25,32.75 59.25,35.25 60.15,36.15 60.39,36.15 7SEG12.P$16 60.88,36.12 61.75,35.25 64,35.25 64.5,35.75 64.5,36.75 65,37.25 72.75,37.25 73,37 73,36.25 7SEG12.P$11 73.25,36 74.75,34.5 84,34.5 85.42,35.92 7SEG14.P$16
  Route2 0.203: 7SEG9.P$11 24,37 34.5,37 35.25,36.25 7SEG4.P$16 35.5,36 36.5,35 49.25,35 | 49.25,35 53.25,31 v57.5,31 | 49.25,35 48.25,36 7SEG4.P$11
  Bottom 0.203: v57.5,31 57,31 56.5,30.5 IC3.3 | 7SEG14.P$11 98,36.25 97,37.25 86.5,37.25 85.5,36.25 7SEG14.P$16
2DATA4  (via drill 0.2)
  Top 0.203: 7SEG14.P$4 88,20.75 89.5,19.25 100.5,19.25 100.5,20.75 7SEG14.P$9 | v57.5,28.5 62.75,23.25 62.75,21 7SEG12.P$4 | v51.25,26.5 51.25,21.5 50.75,21 7SEG4.P$9 49.37,19.59 44.66,19.59 44.25,20 40,20 39.5,20.5 38.34,20.5 7SEG4.P$4
  Route2 0.203: 7SEG9.P$4 13,20.75 13.75,20 24,20 24.88,20.88 7SEG9.P$9 27.12,20.88 28,20 37,20 37.75,20.75 7SEG4.P$4
  Bottom 0.203: 7SEG12.P$9 75.5,21 74.75,21.75 67.5,21.75 66.88,21.12 66.88,20.88 66,20 63.75,20 63,20.75 7SEG12.P$4 | 7SEG14.P$9 100.5,21 93,28.5 v57.5,28.5 57,28.5 56.5,29 IC3.4 56.25,29 53.75,29 v51.25,26.5
2DATA5  (via drill 0.2)
  Top 0.203: 7SEG4.P$3 35.5,21 37,22.5 42.63,22.5 45.13,20 47.24,20 7SEG4.P$8 48.25,21 50.5,23.25 v50.5,24.75 | 7SEG12.P$3 60.5,20.75 62,19.25 71.5,19.25 73,20.75 7SEG12.P$8
  Route2 0.203: 7SEG9.P$3 10.5,21 11.25,21.75 21.25,21.75 22.12,20.88 7SEG9.P$8 23.89,20.88 24.75,21.74 34.49,21.74 34.5,21.75 35.25,21 7SEG4.P$3
  Bottom 0.203: 84.5,21.75 85.25,21 7SEG14.P$3 | 84.5,21.75 79,27.25 57,27.25 56.5,27.75 IC3.5 56.25,27.75 53.5,27.75 v50.5,24.75 | 7SEG14.P$8 97.25,21.75 85,21.75 84.5,21.75 | 7SEG12.P$8 74,20 80.75,20 82.5,21.75 84.5,21.75
2DATA6  (via drill 0.2)
  Top 0.203: v57.5,26 57.75,25.75 57.75,21 7SEG12.P$2
  Bottom 0.203: 19,20 8.75,20 8,20.75 7SEG9.P$2 | 33.75,20 33,20.75 7SEG4.P$2 | 33.75,20 42,20 42.25,20 44,20 | 19,20 18.25,20.75 7SEG9.P$6 | 33.75,20 19,20 | 81.5,19.5 91.75,19.5 93,20.75 7SEG14.P$6 | v57.5,26 57,26 56.5,26.5 IC3.6 | 66.75,19.5 68,20.75 7SEG12.P$6 | 66.75,19.5 59.25,19.5 58.75,20 | 58.75,20 58,20.75 7SEG12.P$2 | 81.5,19.5 7SEG14.P$2 | 66.75,19.5 81.5,19.5 | 44,20 43.25,20.75 7SEG4.P$6 | 58.75,20 44,20
2DATA7
  Top 0.203: 7SEG14.P$5 90.5,21 89,22.5 82,22.5 80.5,21 7SEG14.P$1
  Bottom 0.203: 16.25,21.75 6.25,21.75 5.5,21 7SEG9.P$1 | 31.25,21.75 30.5,21 7SEG4.P$1 | 41.25,21.75 31.25,21.75 | 16.25,21.75 15.5,21 7SEG9.P$5 | 31.25,21.75 16.25,21.75 | 64.25,22.25 61.25,25.25 56.5,25.25 IC3.7 56.25,25.25 56,25 54.75,25 54,24.25 54,24 54,22.75 53,21.75 | 64.25,22.25 65.5,21 7SEG12.P$5 | 64.25,22.25 79,22.25 80.25,21 7SEG14.P$1 | 41.25,21.75 40.5,21 7SEG4.P$5 | 53,21.75 54,21.75 54.47,21.75 7SEG12.P$1 | 53,21.75 41.25,21.75
3DATA0  (via drill 0.2)
  Top 0.203: 7SEG15.P$15 63,17.25 64.5,17.25 64.5,17.75 65,18.25 68.3,18.25 69.5,17.05 69.5,16.75 70,16.25 75,16.25 75.66,16.91 7SEG15.P$10 | 7SEG16.P$15 88,17.25 89.5,18.75 100.5,18.75 100.5,17.25 7SEG16.P$10 | 7SEG13.P$10 25.5,17.25 24.5,18.25 v19,18.25
  Route2 0.203: v50.5,12 50.5,17 7SEG6.P$10 50.75,17.25 53.5,17.25 54.25,18 62,18 62.75,17.25 7SEG15.P$15
  Bottom 0.203: 7SEG15.P$15 63,17 64.5,15.5 99,15.5 100.5,17 7SEG16.P$10 | v19,18.25 14,18.25 13,17.25 7SEG13.P$15 | v50.5,12 50.25,12 49.75,12.5 IC4.15 | 38.75,18 39.5,18.75 49,18.75 50.5,17.25 7SEG6.P$10 | 38.75,18 38,17.25 7SEG6.P$15 | 38.75,18 32.5,18 30.75,16.25 26.5,16.25 25.75,17 7SEG13.P$10
3DATA1  (via drill 0.2)
  Top 0.203: 7SEG15.P$18 55.5,17.25 57,18.75 69.75,18.75 70.5,18 70.5,17.25 7SEG15.P$12 | v39.35,17.4 38.75,18 32.55,18 32.02,17.48 30.7,17.48 7SEG6.P$18
  Bottom 0.203: 19.5,16 6.5,16 5.5,17 7SEG13.P$18 | 19.5,16 20.5,17 7SEG13.P$12 | 19.5,16 23.25,16 25.25,18 29.5,18 30.25,17.25 7SEG6.P$18 | 56.25,14 56.25,16.44 7SEG15.P$18 | 56.25,14 IC4.1 | 79.35,16.1 71.65,16.1 70.75,17 7SEG15.P$12 | 79.35,16.1 80.25,17 7SEG16.P$18 | 79.35,16.1 94.6,16.1 95.5,17 7SEG16.P$12 | v39.35,17.4 40.2,18.25 44.5,18.25 45.5,17.25 7SEG6.P$12 45.75,17 46.5,16.25 48.75,16.25 49,16.5 50,16.5 51.5,15 55.25,15 56.25,14
3DATA2  (via drill 0.2)
  Top 0.203: 7SEG13.P$17 8,17 8,16.5 18.25,6.25 18.25,3.25 19.62,1.88 7SEG13.P$7 21.08,1.88 22.7,3.5 29,3.5 | 29,3.5 43,3.5 44.62,1.88 7SEG6.P$7 45.63,1.88 50,6.25 53.5,6.25 55.5,8.25 | v28.5,12.75 28.5,4 29,3.5 | 82.75,14.75 82.75,17 7SEG16.P$17 | 82.75,14.75 82.75,13.45 71.15,1.85 71.13,1.88 7SEG15.P$7 69.77,1.88 63.4,8.25 55.5,8.25 | 82.75,14.75 95.5,2 7SEG16.P$7 | 55.5,8.25 57.88,10.63 7SEG15.P$17
  Bottom 0.203: v28.5,12.75 32.75,17 7SEG6.P$17 | IC4.2 56.5,12.75 57,13.25 57.25,13.25 57.75,13.75 57.75,17 7SEG15.P$17
3DATA3
  Route2 0.203: 7SEG13.P$11 24,18 33.22,18 34.09,17.12 7SEG6.P$16 36.42,17.12 38.05,18.75 46.5,18.75 48,17.25 7SEG6.P$11
  Bottom 0.203: 7SEG13.P$16 10.5,17.25 12.25,19 21.24,19 | IC4.3 56.5,11.5 57,12 57.25,12 60.25,15 60.25,17 7SEG15.P$16 | 74.25,18.25 7SEG15.P$11 | 86.45,18.25 97,18.25 98,17.25 7SEG16.P$11 | 86.45,18.25 85.58,17.38 7SEG16.P$16 | 7SEG15.P$16 60.5,17.25 61.5,18.25 74.25,18.25 | 7SEG15.P$16 60.25,17.25 58,19.5 39,19.5 38.5,19 21.24,19 | 74.25,18.25 86.45,18.25 | 7SEG13.P$11 21.24,19
3DATA4  (via drill 0.2)
  Top 0.203: 87.08,1 80,1 79.1,1.9 75.68,1.9 7SEG15.P$9 74.37,1.88 73.5,2.75 73.49,2.74 72.76,2.74 72.28,2.25 72.25,2.25 71,1 63.84,1 7SEG15.P$4 62.95,6.8 62,7.75 56,7.75 v55.25,7 54.25,6 54.25,5.5 50.75,2 7SEG6.P$9 | 87.08,1 96,1 96.5,1.5 96.5,3 97,3.5 99,3.5 100.5,2 7SEG16.P$9 | 7SEG13.P$9 25.5,2 25.5,2.25 25,2.75 22.75,2.75 22.25,2.25 22.25,1.25 22,1 13.84,1 7SEG13.P$4 | 7SEG16.P$4 87.08,1
  Route2 0.203: 7SEG13.P$9 25.75,2 26.5,2.75 37,2.75 37.75,2 7SEG6.P$4
  Bottom 0.203: IC4.4 56.25,10 55.25,9 v55.25,7 54.25,6 52.75,6 50,3.25 39.25,3.25 38,2 7SEG6.P$4
3DATA5
  Top 0.203: 7SEG13.P$3 11.8,0.5 22.5,0.5 23,1 23,1.75 7SEG13.P$8 24.45,1.88 25.3,1.02 34.02,1.02 34.9,1.9 35.4,1.9 7SEG6.P$3 36.12,1.88 37,1 46,1 46.88,1.88 7SEG6.P$8 49.37,1.88 50.23,1.02 58.24,1.02 59.13,1.91 60.39,1.91 7SEG15.P$3 60.44,1.9 61.27,1.9 62.58,0.59 72,0.59 73.12,1.71 7SEG15.P$8
  Bottom 0.203: 83,3.25 84,3.25 84.5,2.75 | 83,3.25 67,3.25 62,8.25 57,8.25 56.5,8.75 IC4.5 | 84.5,2.75 85.25,2 7SEG16.P$3 | 7SEG15.P$8 74,1 80.75,1 83,3.25 | 7SEG16.P$8 97.25,2.75 84.5,2.75
3DATA6  (via drill 0.2)
  Top 0.203: 7SEG6.P$2 33,2 34,2 34.75,2.75 42.17,2.75 7SEG6.P$6 | v57.5,7 57.75,6.75 57.75,2 7SEG15.P$2
  Bottom 0.203: 7SEG13.P$2 8,1.75 9.3,0.45 16.7,0.45 19.45,0.45 19.5,0.5 | 19.5,0.5 19.55,0.45 44.55,0.45 | 19.5,0.5 18.25,1.75 7SEG13.P$6 | 7SEG16.P$6 93,1.75 91.7,0.45 81.45,0.45 | v57.5,7 57,7 56.5,7.5 IC4.6 | 66.7,0.45 68,1.75 7SEG15.P$6 | 59.3,0.45 66.7,0.45 | 59.3,0.45 58,1.75 7SEG15.P$2 | 81.45,0.45 7SEG16.P$2 | 81.45,0.45 66.7,0.45 | 44.55,0.45 43.25,1.75 7SEG6.P$6 | 59.3,0.45 44.55,0.45
3DATA7  (via drill 0.2)
  Top 0.203: 7SEG16.P$5 90.5,3 90,3.5 82,3.5 80.5,2 7SEG16.P$1 | v55.25,6 54.75,5.5 54.75,2.5 55.25,2 7SEG15.P$1
  Bottom 0.203: 14.75,2.75 6.25,2.75 5.5,2 7SEG13.P$1 | 14.75,2.75 15.5,2 7SEG13.P$5 | 14.75,2.75 29.5,2.75 30.25,2 7SEG6.P$1 30.5,2 31.5,2 32.5,1 39.75,1 40.5,1.75 7SEG6.P$5 40.5,2 41.25,2.75 56.25,2.75 | v55.25,6 56,6 56.25,6.25 IC4.7 | 64.75,2.75 65.5,2 7SEG15.P$5 | 56.25,2.75 64.75,2.75 | 56.25,2.75 55.5,2 7SEG15.P$1 | 64.75,2.75 79.5,2.75 80.25,2 7SEG16.P$1
COM0  (via drill 0.2)
  Top 0.762: 7SEG13.P$14 15.5,17.25 17.62,19.38 26.38,19.38 27,20 v27,23.75
  Route2 0.762: v25.25,11.5 23.5,13.25 19.25,13.25 15.5,17 7SEG13.P$14 | 4,58.43 4,39.25 5.25,38 13.75,38 15.5,36.25 7SEG9.P$14 15.75,36 19.75,32 26,32 27,31 v27,23.75 | 7SEG5.P$14 15.5,55.25 14.25,56.5 5.93,56.5 4,58.43 | 4,58.43 4,59.75 5.55,61.3 9.05,61.3 11.75,64 11.75,70.25 15.5,74 7SEG1.P$14
  Bottom 0.762: v25.25,11.5 25.25,10 32,3.25 34.75,3.25 35,3.5 R1.2
COM1  (via drill 0.2)
  Top 0.762: v30,12.75 v38,4.75 | v15.25,32 17.75,34.5 17.75,35.75 18,36 7SEG9.P$13 | v10.5,47.5 18,55 7SEG5.P$13 | v10.5,71.25 15.25,71.25 18,74 7SEG1.P$13
  Route2 0.762: v30,12.75 27,15.75 19.5,15.75 18.25,17 7SEG13.P$13 | v15.25,32 12,28.75 9,28.75 3.75,23.5 | 3.75,23.5 3.75,8 6.5,5.25 18.75,5.25 20,4 37.25,4 v38,4.75 | 3.75,23.5 3.75,26.7 v5.35,28.3
  Bottom 0.762: v38,4.75 37.25,4.75 36.75,5.25 R2.2 | 8.5,45.5 4,41 4,31 5.35,29.65 v5.35,28.3 | 8.5,45.5 v10.5,47.5 | 8.5,45.5 8.25,45.75 6.37,45.75 4.01,48.11 4.01,53.99 4,54 4,61 8.08,65.08 8.08,68.83 v10.5,71.25
COM2  (via drill 0.2)
  Top 0.762: v41,12.25 41,7.5 v41.25,7.25 41.5,7.5 43.75,7.5 43.75,7.75 47,11 50,11 50.06,11.06 50.89,11.06 52.75,12.92 v52.75,13.75
  Route2 0.762: 51,38.25 52,39.25 52,41.25 51.5,41.25 49.75,43 49.75,52.25 52,54.5 52,59.87 49.89,61.98 | 51,38.25 50.75,38 42.25,38 40.5,36.25 7SEG4.P$14 | 7SEG3.P$14 40.5,55.25 41.75,56.5 46,56.5 47.12,57.62 48.64,57.62 49.38,58.36 49.38,59.45 49.89,59.96 49.89,61.98 | 7SEG2.P$14 40.5,74 49.8,64.7 49.8,62.07 49.89,61.98 | v52.75,13.75 54.75,15.75 76.25,15.75 77,16.5 77,33 75.25,34.75 54.5,34.75 51,38.25 | 7SEG6.P$14 41,16.62 v41,12.25
  Bottom 0.762: v41.25,7.25 36.75,7.25 R3.2
COM3
  Top 0.762: 29,22 43,36 7SEG4.P$13 | 29,22 29,20.25 30.44,18.81 40.6,18.81 42.16,17.25 43,17.25 7SEG6.P$13 | 7SEG3.P$13 43,55 39,51 39,49 37,47 32,47 29,44 | 29,44 29,66 30.5,67.5 36.5,67.5 43,74 7SEG2.P$13 | 29,44 29,22
  Bottom 0.762: R4.2 36.75,8.75 37,9 40.5,9 45.09,13.59 45.09,15.16 43.25,17 7SEG6.P$13
COM4  (via drill 0.2)
  Top 0.762: v39.5,10.25 39.75,10 39.75,7 41.25,5.5 v48,5.5 | 7SEG15.P$14 65.5,17.02 64.95,16.47 64.95,8.55 v65.75,7.75 68.25,7.75 77,16.5 77,24.5 66.5,35 | 66.5,35 65.5,36 7SEG12.P$14 | 54,47.25 58.75,47.25 64.75,53.25 64.75,54.25 65.5,55 7SEG10.P$14 | 54,47.25 54,33 57,30 61.5,30 66.5,35 | v57,72 53.5,68.5 53.5,47.75 54,47.25
  Route2 0.762: v48,5.5 50.5,8 65.5,8 v65.75,7.75
  Bottom 0.762: v39.5,10.25 36.75,10.25 R5.2 | v57,72 63.5,72 65.5,74 7SEG7.P$14
COM5  (via drill 0.2)
  Top 0.762: 75,53.75 69.5,53.75 68.25,55 7SEG10.P$13 | 75,53.75 77,53.75 77.75,54.5 77.75,61.5 v67.25,72 | v66.75,10.25 68,11.5 68,17 7SEG15.P$13 | v78.25,12.25 78.25,26 68.25,36 7SEG12.P$13 | v77,41.75 77,51.75 75,53.75 | v30.75,10.25 30,9.5 30,8.4 30.8,7.6 v30.8,7.5
  Route2 0.762: v38,12 36.25,10.25 v30.75,10.25 | v30.8,7.5 39.5,7.5 40.75,6.25 47,6.25 50.5,9.75 66.25,9.75 v66.75,10.25 | 7SEG12.P$13 68.25,36.25 69.5,37.5 75,37.5 76.11,38.62 76.18,38.62 77,39.43 v77,41.75
  Bottom 0.762: v38,12 36.75,12 R6.2 | v78.25,12.25 76.25,10.25 v66.75,10.25 | 7SEG7.P$13 67.25,73.33 v67.25,72
COM6  (via drill 0.2)
  Top 0.762: 7SEG11.P$14 90.5,55 89.25,53.75 79.92,53.75 79.08,54.6 79.08,56.92 79,57 79,62.5 90.5,74 7SEG8.P$14 | 7SEG16.P$14 90.5,14 91.25,13.25 98.75,13.25 102,16.5 102,24.5 90.5,36 7SEG14.P$14
  Route2 0.762: v43,13.5 45.5,11 65.75,11 69.25,14.5 88,14.5 90.5,17 7SEG16.P$14 | 7SEG11.P$14 90.5,55 95.5,50 96.75,50 102,44.75 102,39.43 101.18,38.62 101.11,38.62 100,37.5 91.75,37.5 90.5,36.25 7SEG14.P$14
  Bottom 0.762: v43,13.5 37,13.5 36.75,13.75 R7.2
COM7  (via drill 0.2)
  Top 0.762: 101.75,46.5 93.25,55 7SEG11.P$13 | 101.75,46.5 102,46.25 v102,34.5 102,33 100,31 98.25,31 93.25,36 7SEG14.P$13 | 7SEG8.P$13 93.25,74 97.75,69.5 97.75,63.75 102,59.5 102,46.75 101.75,46.5 | v44,14.25 49,14.25 50,13.25 v51.5,13.25 | v91.75,14.5 93,15.75 93,17 7SEG16.P$13
  Route2 0.762: v51.5,13.25 52.25,12.5 v59,12.5
  Bottom 0.762: v44,14.25 43.25,15 37.25,15 36.75,15.5 R8.2 | v59,12.5 61,14.5 v91.75,14.5 99.83,14.5 102,16.67 v102,34.5
CONF0  (via drill 0.2)
  Top 0.203: v15.75,34 16.75,35 v16.75,51.25 | v20.25,53.25 21.5,54.5 21.5,63.5 21.25,63.75 v21.25,68
  Bottom 0.203: v15.75,34 17.75,34 18,33.75 J3.1 | v16.75,51.25 18,52.5 J2.1 18,52.75 18.5,53.25 v20.25,53.25 | 21.25,69 20.75,69 18.25,71.5 18,71.5 J1.1 | 21.25,69 49,69 49.5,68.5 IC1.14 | 21.25,69 v21.25,68
CONF1  (via drill 0.2)
  Top 0.203: v15.25,25.25 21.5,31.5 v21.5,45 22,45.5 v22,64
  Route2 0.203: v42,8.5 15,8.5 v14,9.5 14,18.5 13,19.5 10.5,19.5 9.5,20.5 9.5,21.18 13.57,25.25 15,25.25 v15.25,25.25
  Bottom 0.203: IC1.11 49.5,64.5 49,64 v22,64 18,64 J1.7 | IC2.11 49.5,45.5 49,45 v21.5,45 18,45 J2.7 | v14,9.5 12.25,7.75 IC5.11 | v15.25,25.25 15.75,25.75 18,25.75 J3.7 18,26 18.5,26.5 49.5,26.5 IC3.11 | v42,8.5 44.25,8.5 45.25,7.5 49.5,7.5 IC4.11
CONF2  (via drill 0.2)
  Top 0.203: v27.25,61 v27.25,43.75 24.5,41 v24.5,25.75
  Route2 0.203: v45.75,8.25 45.25,8.75 43.5,8.75 43,9.25 v16.25,9.25
  Bottom 0.203: IC2.10 49.5,44.25 49,43.75 v27.25,43.75 19.25,43.75 18,42.5 J2.9 | 27.25,62.75 19.25,62.75 18,61.5 J1.9 | 27.25,62.75 49,62.75 49.5,63.25 IC1.10 | 27.25,62.75 v27.25,61 | 18,23.5 17,24.5 5,24.5 4.25,23.75 4.25,14 11.5,6.75 11.75,6.75 12,6.5 IC5.10 12.25,6.5 13.5,6.5 v16.25,9.25 | IC4.10 49.75,6.5 50.5,7.25 50.5,8 50.25,8.25 v45.75,8.25 | 23,24.75 19.25,24.75 18,23.5 | 23,24.75 49,24.75 49.5,25.25 IC3.10 | 18,23.5 J3.9 | 23,24.75 24,25.75 v24.5,25.75
CONF3  (via drill 0.2)
  Top 0.203: v5.55,14.9 4.25,16.2 4.25,46.7 v5.5,47.95 | v44,9.5 42,11.5 42,12.75 41.15,13.6 18.1,13.6 v15.5,11 | v15.75,29 19.25,32.5 19.25,40.5 18.75,41 v18.75,46.25 | v36.5,48 v36.5,66.5
  Bottom 0.203: J1.5 v36.5,66.5 49,66.5 49.5,66 IC1.12 | IC3.12 49.5,28 49,28.5 J3.5 17.5,29 v15.75,29 | v5.5,47.95 6.3,48.75 16.75,48.75 J2.5 18.75,47.5 | IC5.12 12,9 11.5,9.5 9.7,9.5 8.45,10.75 8.5,10.75 | v44,9.5 49,9.5 49.5,9 IC4.12 | v15.5,11 15.25,10.75 8.5,10.75 | 18.75,47.5 36.5,47.5 | 36.5,47.5 49,47.5 49.5,47 IC2.12 | 18.75,47.5 v18.75,46.25 | 36.5,47.5 v36.5,48 | v5.55,14.9 5.55,13.7 8.5,10.75
CONF4  (via drill 0.2)
  Top 0.203: v28,67.25 28,61.75 | 28,61.75 v28,48.75 | 28,61.75 24,61.75 24,34.25 v23.75,34
  Route2 0.203: v50.5,27.25 49.75,27.25 49.75,17.5 47.65,15.4 v47.65,12
  Bottom 0.203: IC2.13 49.5,48.25 49,48.75 v28,48.75 19.25,48.75 18,50 J2.3 | IC1.13 49.5,67.25 v28,67.25 20,67.25 18.25,69 18,69 J1.3 | v50.5,27.25 50.5,29 49.75,29 IC3.13 49.5,29.25 49,29.75 21,29.75 | 16.75,29.75 11.25,29.75 8.75,27.25 5,27.25 3.75,26 3.75,9 8.5,4.25 12.75,4.25 13.25,4.75 17,4.75 17,9.75 16.5,10.25 12.25,10.25 IC5.13 | 16.75,29.75 18,31 J3.3 | 16.75,29.75 21,29.75 | v47.65,12 47.65,10.7 48.22,10.13 IC4.13 | v23.75,34 23.75,32.5 21,29.75
CONF5  (via drill 0.2)
  Top 0.203: v10.75,6.5 8,9.25 8,11.75 6.25,13.5 6.25,21.75 | v5.75,22.25 6.25,21.75 | 6.25,21.75 v6.25,41.5 6.3,41.55 v6.3,60.35
  Route2 0.203: v39.5,4.5 37.5,6.5 v10.75,6.5
  Bottom 0.203: v39.5,4.5 49,4.5 49.5,5 IC4.9 | v5.75,22.25 6.75,23.25 13,23.25 J3.10 | v6.25,41.5 12.25,41.5 13,42.25 J2.10 | v6.3,60.35 12.1,60.35 13,61.25 J1.10
CONF6  (via drill 0.2)
  Top 0.203: v11,12 7,16 v7,25.4 7,42.5 | 7,42.5 v8,43.5 | v8.2,62.25 7,61.05 7,42.5
  Bottom 0.203: v11,12 11.5,12 12,11.5 IC5.14 | v7,25.4 10.25,25.4 10.6,25.75 13,25.75 J3.8 | v8,43.5 11.75,43.5 13,44.75 J2.8 | v8.2,62.25 8.7,62.75 12,62.75 13,63.75 J1.8
GND  (via drill 0.35)
  Route15 0.762: v55.65,4.2 55.02,3.58 53.75,4.85 | 53.55,41.45 53.55,60 | 53.55,18.5 53.55,22 | v17.5,4 9.5,4 8.08,5.42 v8.08,12.81 | v22.1,14.4 21.02,13.32 21.02,5.67 v20.4,5.05 | v10.5,65.5 10.1,65.5 4,59.4 4,48 5.6,46.4 9.35,46.4 | 53.55,18.5 29.25,18.5 v25.15,14.4 | v7.97,13.95 5.05,13.95 4,15 4,21 4.08,21.07 4.08,25.2 6.22,27.35 9.65,27.35 9.5,27.5 | v46.7,12.72 46.7,5.3 48,4 52.9,4 53.75,4.85 | v46.7,31.88 46.7,24.95 48.66,23 52.55,23 53.55,22 | v46.75,69.88 46.75,62.25 47.7,61.3 52.25,61.3 53.55,60 | 53.55,60 53.55,60.5 v55.1,62.05 | 53.55,41 52.55,42 48,42 46.7,43.3 v46.7,50.8 | 53.55,41 53.55,41.45 | v55.16,43.05 53.55,41.45 | 53.75,4.85 53.74,4.86 53.74,14.09 53.55,14.28 53.55,18.5 | 53.55,22 55,23.45 v55,24.05 53.55,25.5 53.55,41 | v12,27.35 9.72,27.35 9.57,27.5 9.5,27.5 | 9.5,27.5 4,33 4,41.05 9.35,46.4 | 9.35,46.4 v11.95,46.4
  Bottom 0.762: IC4.8 v55.65,4.21 v55.65,4.2 | v55,24.05 55.05,24.05 IC3.8 | v17.5,4 18.5,5 IC5.8 v20.4,5.05 | v22.1,14.4 23.4,14.4 Q1.9 24.29,14.4 v25.15,14.4 | v12,27.35 13,28.35 J3.6 | v11.95,46.4 13,47.45 J2.6 | J1.6 12,65.5 v10.5,65.5 | v7.97,13.95 C5.2 v8.08,12.81 | C4.2 46.73,12.75 v46.7,12.72 | C3.2 46.73,31.9 v46.7,31.88 | C1.2 46.73,69.9 v46.75,69.88 | v55.1,62.05 IC1.8 | v55.16,43.05 IC2.8 | C2.2 46.73,50.83 v46.7,50.8
  pour Route15: 3,76 3,0 103,0 103,76
N$1  (via drill 0.2)
  Top 0.203: v48.25,49.5 47.5,50.25 47.5,54.5 47.15,54.85 v47.15,60.5
  Bottom 0.203: v48.25,49.5 49.5,49.5 IC2.14 | v47.15,60.5 47.15,62 49.5,62 IC1.9
N$2
  Bottom 0.203: R1.1 36.5,3.75 35.75,4.5 33.25,4.5 Q1.18
N$3
  Bottom 0.203: R2.1 35,5.5 33.25,5.5 Q1.17
N$4  (via drill 0.2)
  Top 0.203: v51.25,7 53.75,9.5 53.75,17.5 54.5,18.25 54.5,20.5 53.3,21.7 v53.3,23.6
  Bottom 0.203: v51.25,7 51.25,9.75 49.75,11.25 IC4.14 | v53.3,23.6 52.9,24 49.75,24 IC3.9
N$5
  Bottom 0.203: R3.1 35,7 33.25,7 Q1.16
N$6
  Bottom 0.203: IC5.7 19,6.25 19.25,6 21.5,6 23,4.5 23.5,4.5 Q1.1
N$7
  Bottom 0.203: IC5.6 19,7.5 19.5,7 21.75,7 23,5.75 23.5,5.75 Q1.2
N$8
  Bottom 0.203: IC5.5 19,8.75 19.5,8.25 21.75,8.25 22.75,7.25 23.5,7.25 Q1.3
N$9
  Bottom 0.203: IC5.4 19,10 19.5,9.5 22,9.5 23,8.5 23.5,8.5 Q1.4
N$10
  Bottom 0.203: R4.1 35,8.5 33.25,8.5 Q1.15
N$11
  Bottom 0.203: R5.1 35,10.25 34.5,9.75 33.25,9.75 Q1.14
N$12
  Bottom 0.203: IC5.3 19,11.25 19.5,10.75 22,10.75 23,9.75 23.5,9.75 Q1.5
N$13
  Bottom 0.203: IC5.2 19,12.5 19.25,12.25 21.5,12.25 22.75,11 23.5,11 Q1.6
N$14
  Bottom 0.203: IC5.1 19,13.75 19.25,13.5 21,13.5 22.25,12.25 23.5,12.25 Q1.7
N$15
  Bottom 0.203: IC5.15 12.25,12.75 12.5,13 16.5,13 18.25,14.75 20.5,14.75 21.75,13.5 23.5,13.5 Q1.8
N$16
  Bottom 0.203: R6.1 35,12 34,11 33.25,11 Q1.13
N$17
  Bottom 0.203: Q1.12 33.25,12.25 33.75,12.25 34.38,12.88 34.38,13.1 R7.1
N$18
  Bottom 0.203: R8.1 35,15.5 32.25,15.5 31.75,15 31.75,14 32.25,13.5 33,13.5 Q1.11
N$19  (via drill 0.2)
  Top 0.203: v48.25,30.75 47.5,31.5 47.5,35.5 47.1,35.9 v47.1,41.5
  Bottom 0.203: v48.25,30.75 49.25,30.75 49.5,30.5 IC3.14 | v47.1,41.5 48.6,43 49.5,43 IC2.9
VCC  (via drill 0.35)
  Top 0.762: 52.3,33 52.3,52 | 52.3,33 52.3,16.3 51.45,15.45 v49.15,15.45 12.3,15.45 v11.9,15.05 10.7,15.05 9.14,16.61 9.14,31.86 | v49,34 51.3,34 52.3,33 | v49,53 51.3,53 52.3,52 | v49,72 51,72 52.3,70.7 52.3,52 | v10,69 9.9,69 9.14,68.25 9.14,49.15 | v10,50 9.14,49.15 | v10,31 9.14,31.86 | 9.14,49.15 9.14,31.86
  Bottom 0.762: IC5.16 C5.1 11.88,15.05 v11.9,15.05 | IC4.16 48.32,13.95 C4.1 48.27,14.57 v49.15,15.45 | IC3.16 48.33,32.95 C3.1 48.27,33.27 v49,34 | IC2.16 48.33,51.95 C2.1 48.27,52.27 v49,53 | IC1.16 48.33,70.94 C1.1 48.27,71.28 v49,72 | J3.4 12.96,31 v10,31 | J2.4 12.96,50 v10,50 | J1.4 12.96,69 v10,69

### Text on the board
Dimension: V-CUT
tNames: Could you write production code here? | JLCJLCJLCJLC
bNames: DATA | 2023/06/04 / Nanraka / operate_7seg_vsr2 | NC | !OE | VCC | RCLK | SCLK | COM | !SCLR | DATA' | DATA | NC | !OE | VCC | RCLK | GND | SCLK | COM | !SCLR | DATA' | DATA | NC | !OE | VCC | RCLK | GND | SCLK | COM | !SCLR | DATA'